# Altium schematic sheet Air530_Air530Z_Air530H.SchDoc
size 431 x 279 mm
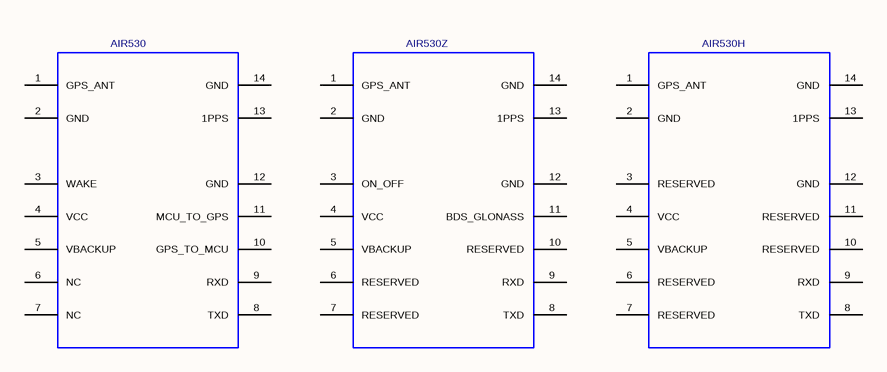
[diagram p0: Air530_Air530Z_Air530H.SchDoc]

## Parts
U1  AIR530H  [AIR530]
U2  AIR530  [AIR530]
U3  AIR530Z  [AIR530]

## Nets

Not connected (* = marked no-connect by the designer): U1 1(GPS_ANT) 2(GND) 3(RESERVED) 4(VCC) 5(VBACKUP) 6(RESERVED) 7(RESERVED) 8(TXD) 9(RXD) 10(RESERVED) 11(RESERVED) 12(GND) 13(1PPS) 14(GND); U2 1(GPS_ANT) 2(GND) 3(WAKE) 4(VCC) 5(VBACKUP) 6(NC) 7(NC) 8(TXD) 9(RXD) 10(GPS_TO_MCU) 11(MCU_TO_GPS) 12(GND) 13(1PPS) 14(GND); U3 1(GPS_ANT) 2(GND) 3(ON_OFF) 4(VCC) 5(VBACKUP) 6(RESERVED) 7(RESERVED) 8(TXD) 9(RXD) 10(RESERVED) 11(BDS_GLONASS) 12(GND) 13(1PPS) 14(GND)

## Library data of the parts
U1 = AIR530H: GPS/Beidou/GLONASS module;9.9*12.9*2.3mm; Manufacture: Luat; Geometry.Height: 2.3 MM; PCB DECAL: AIR530; Manufacturer P/N: Air530H
U2 = AIR530: GPS/Beidou/GLONASS module;9.9*12.9*2.3mm; Manufacture: Luat; Geometry.Height: 2.3MM; Manufacture P/N: Air530; PCB DECAL: AIR530
U3 = AIR530Z: GPS/Beidou/GLONASS module;9.9*12.9*2.3mm; Manufacture: Luat; Geometry.Height: 2.3mm; Manufacturer P/N: Air530Z; PCB DECAL: AIR530